# EasyEDA schematic SCH_Nucleo扩展板_LCD扩展板_v3_2022-11-11.json

## Sheets
1 连接器: TITLE: Sheet_1; REV: 1.0; Date: 2022-09-22; Sheet: 1/1; Company: Your Company
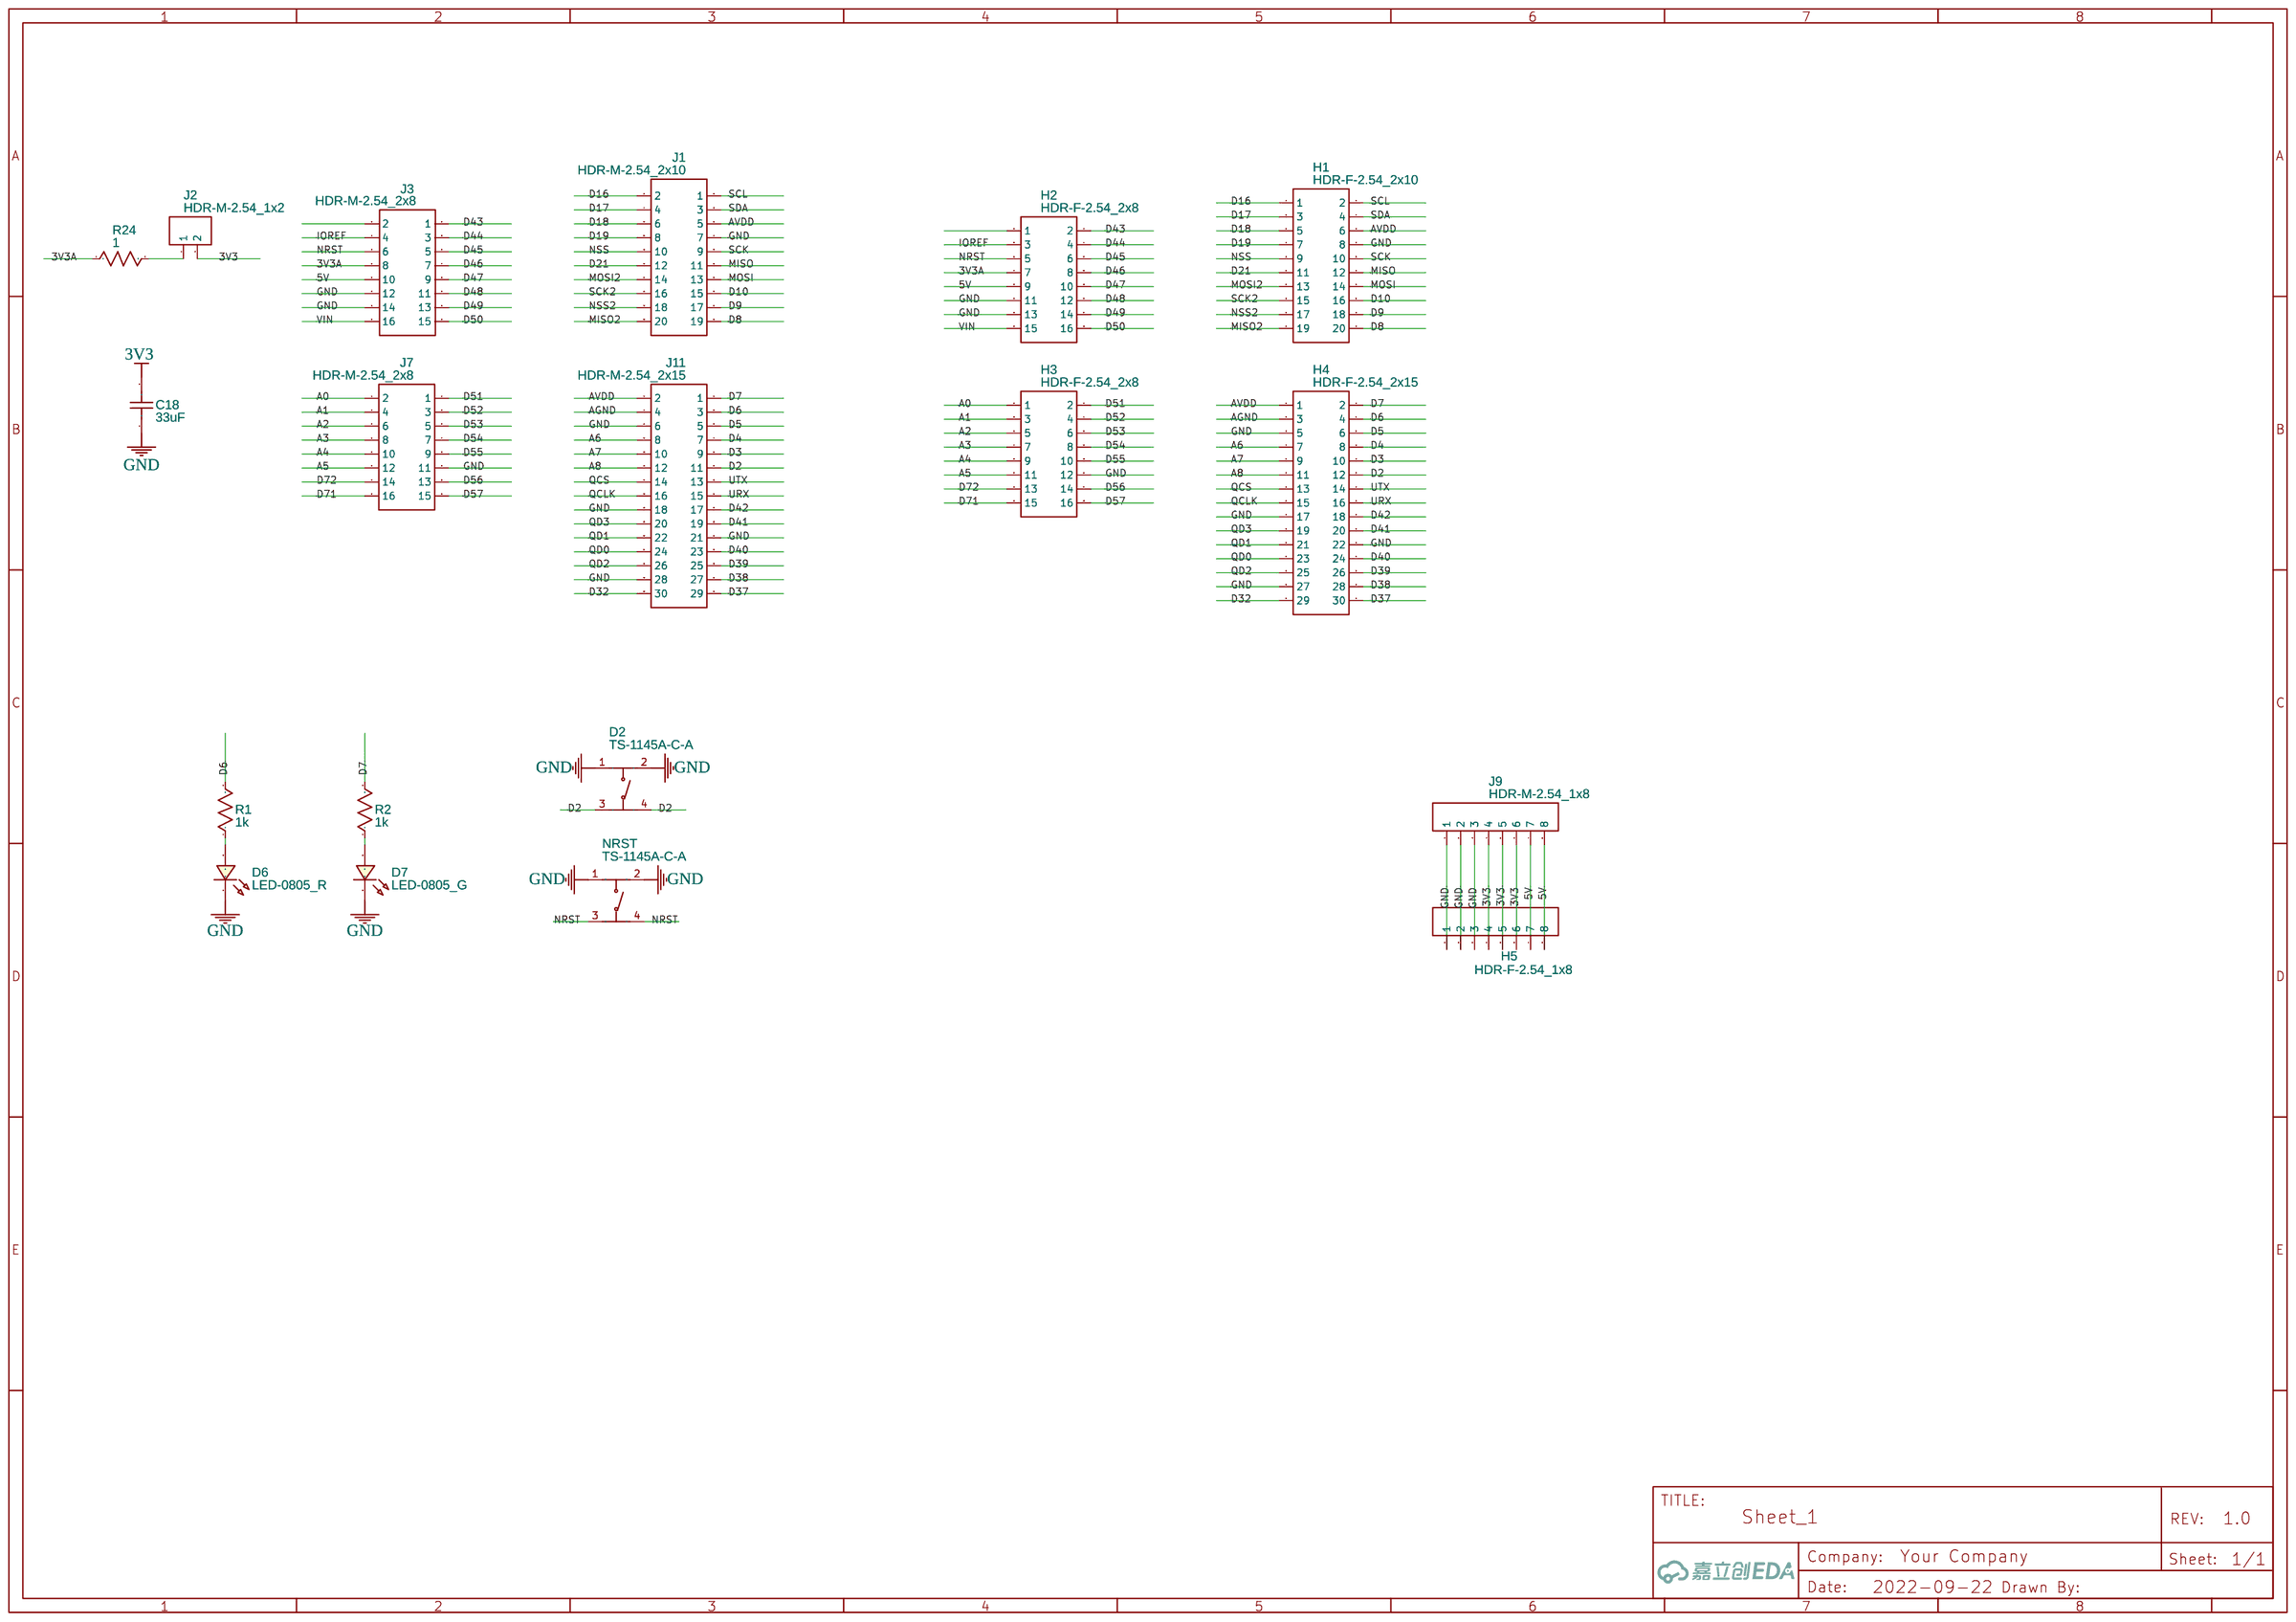
[diagram p0: 连接器]
2 存储: TITLE: Sheet_2; Date: 2022-09-23; Drawn By: minichao
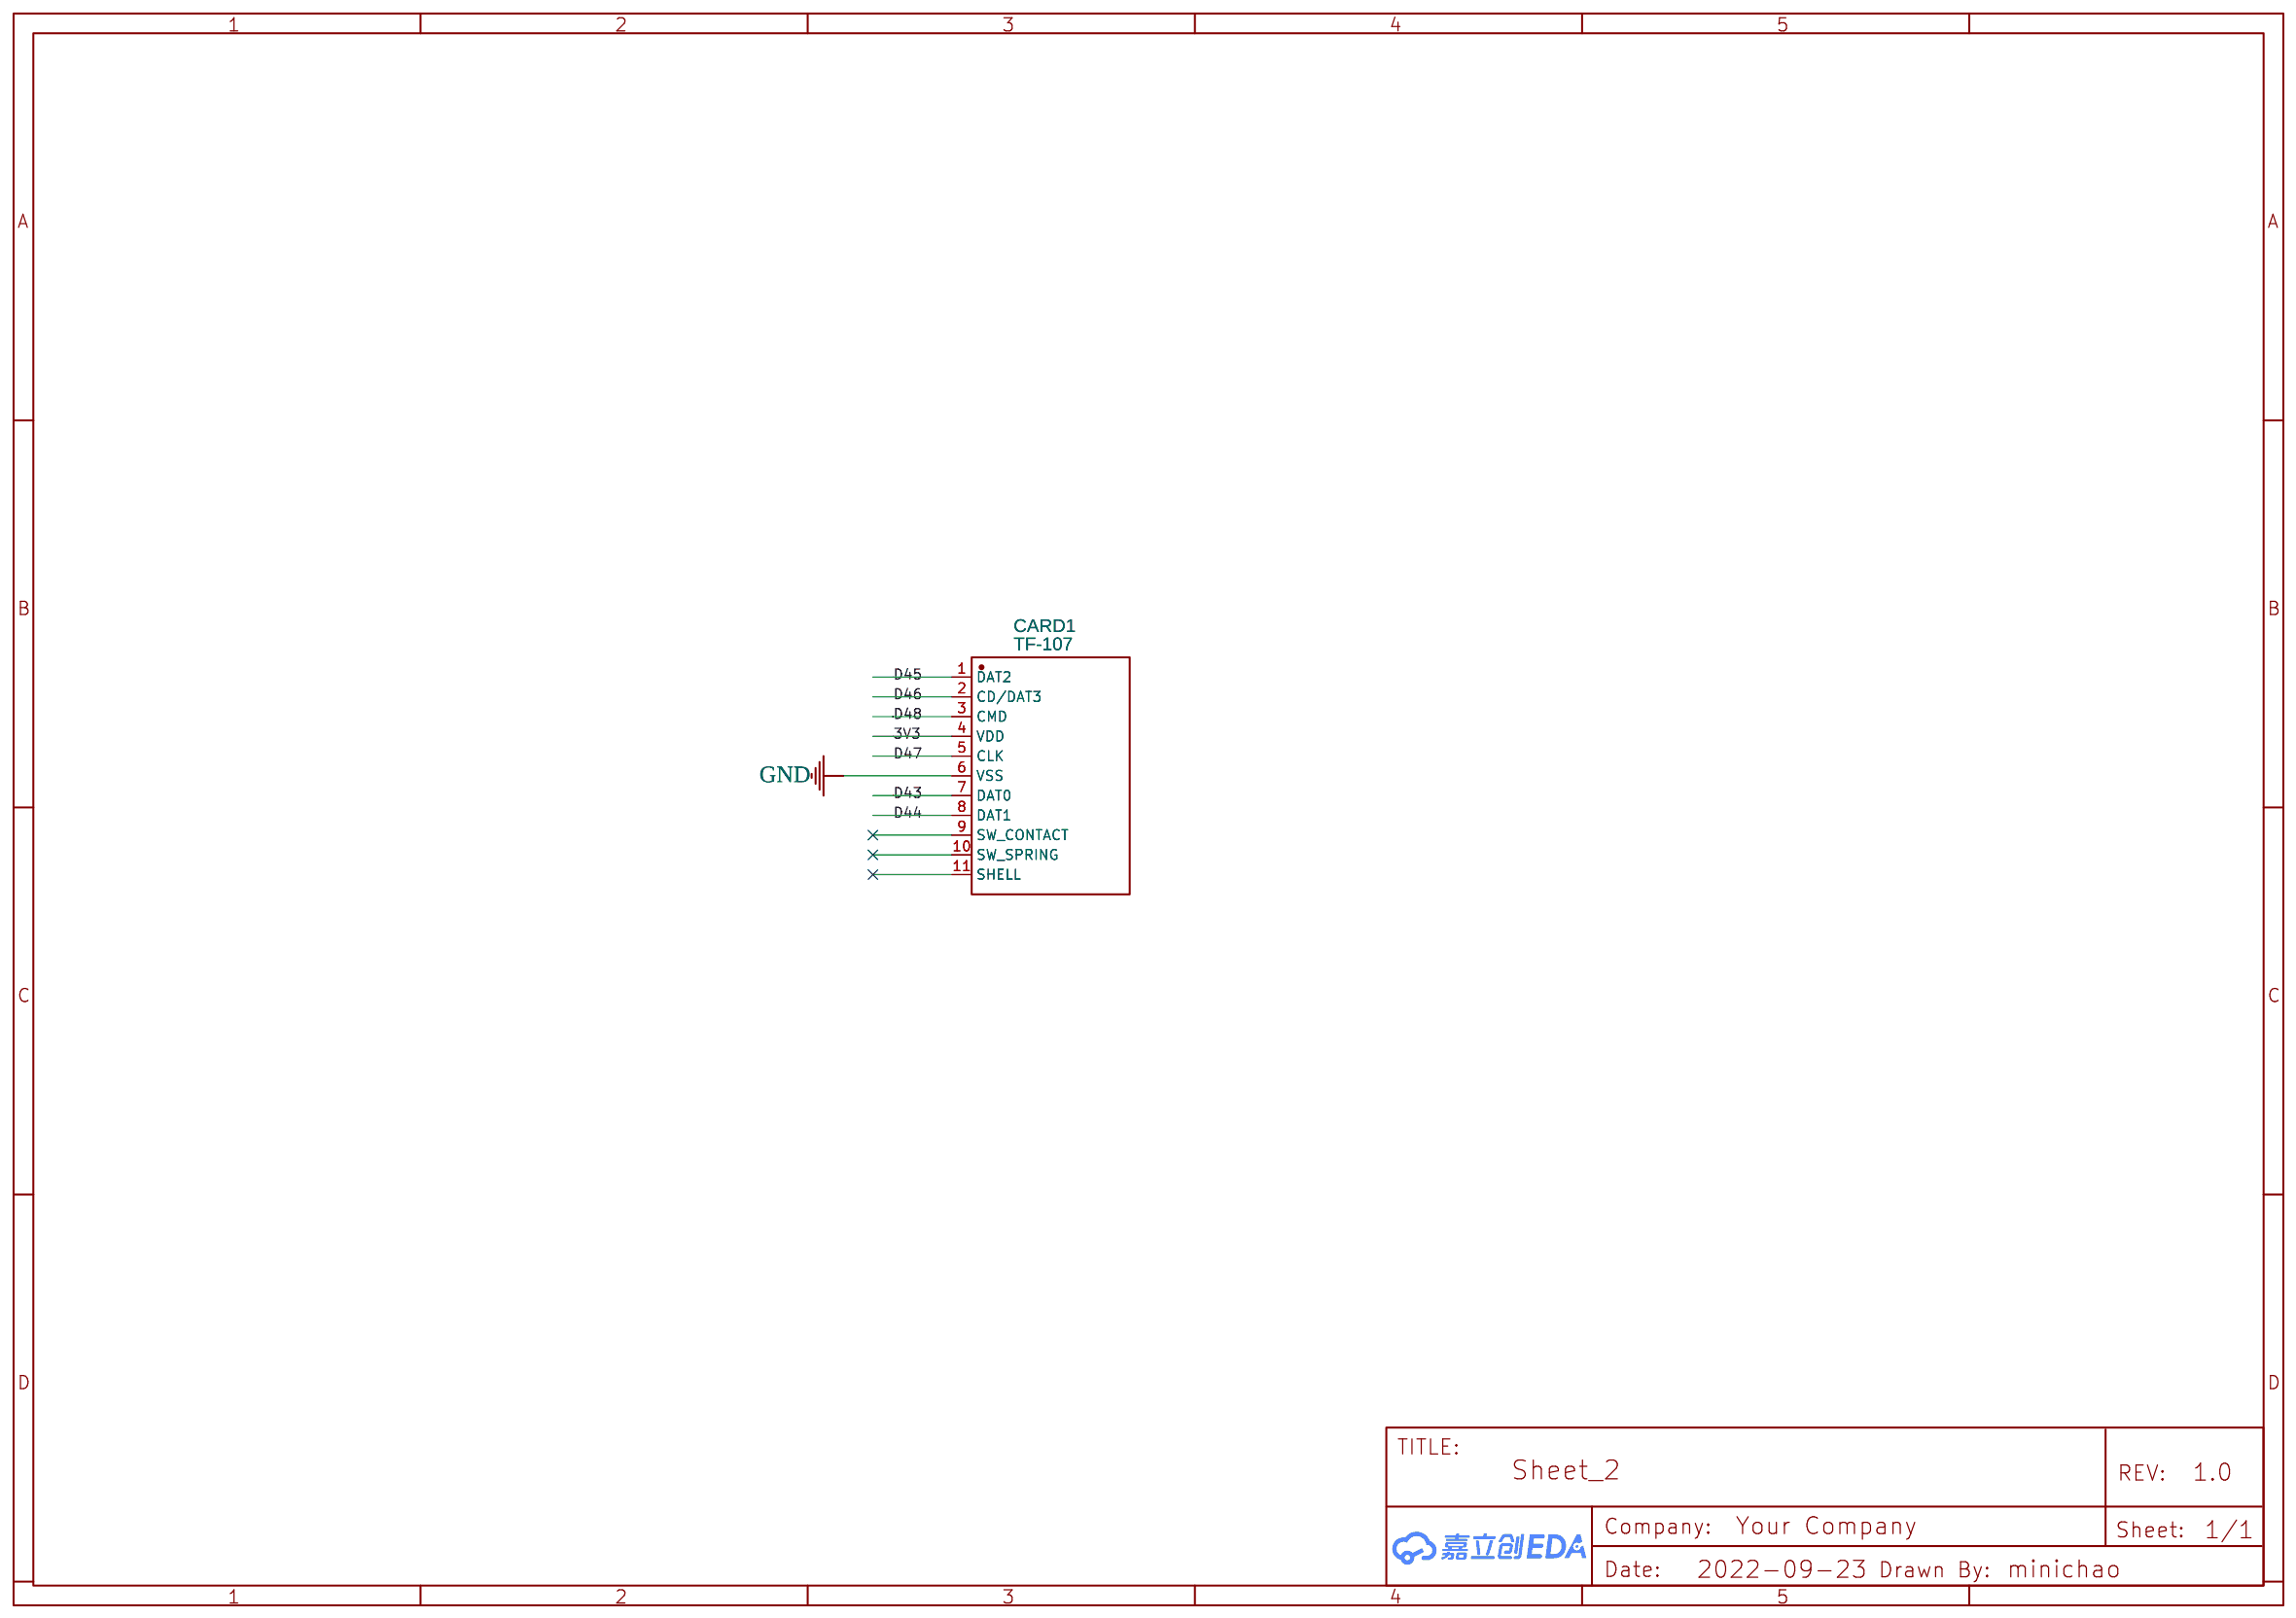
[diagram p1: 存储]
3 显示: Date: 2022-10-17
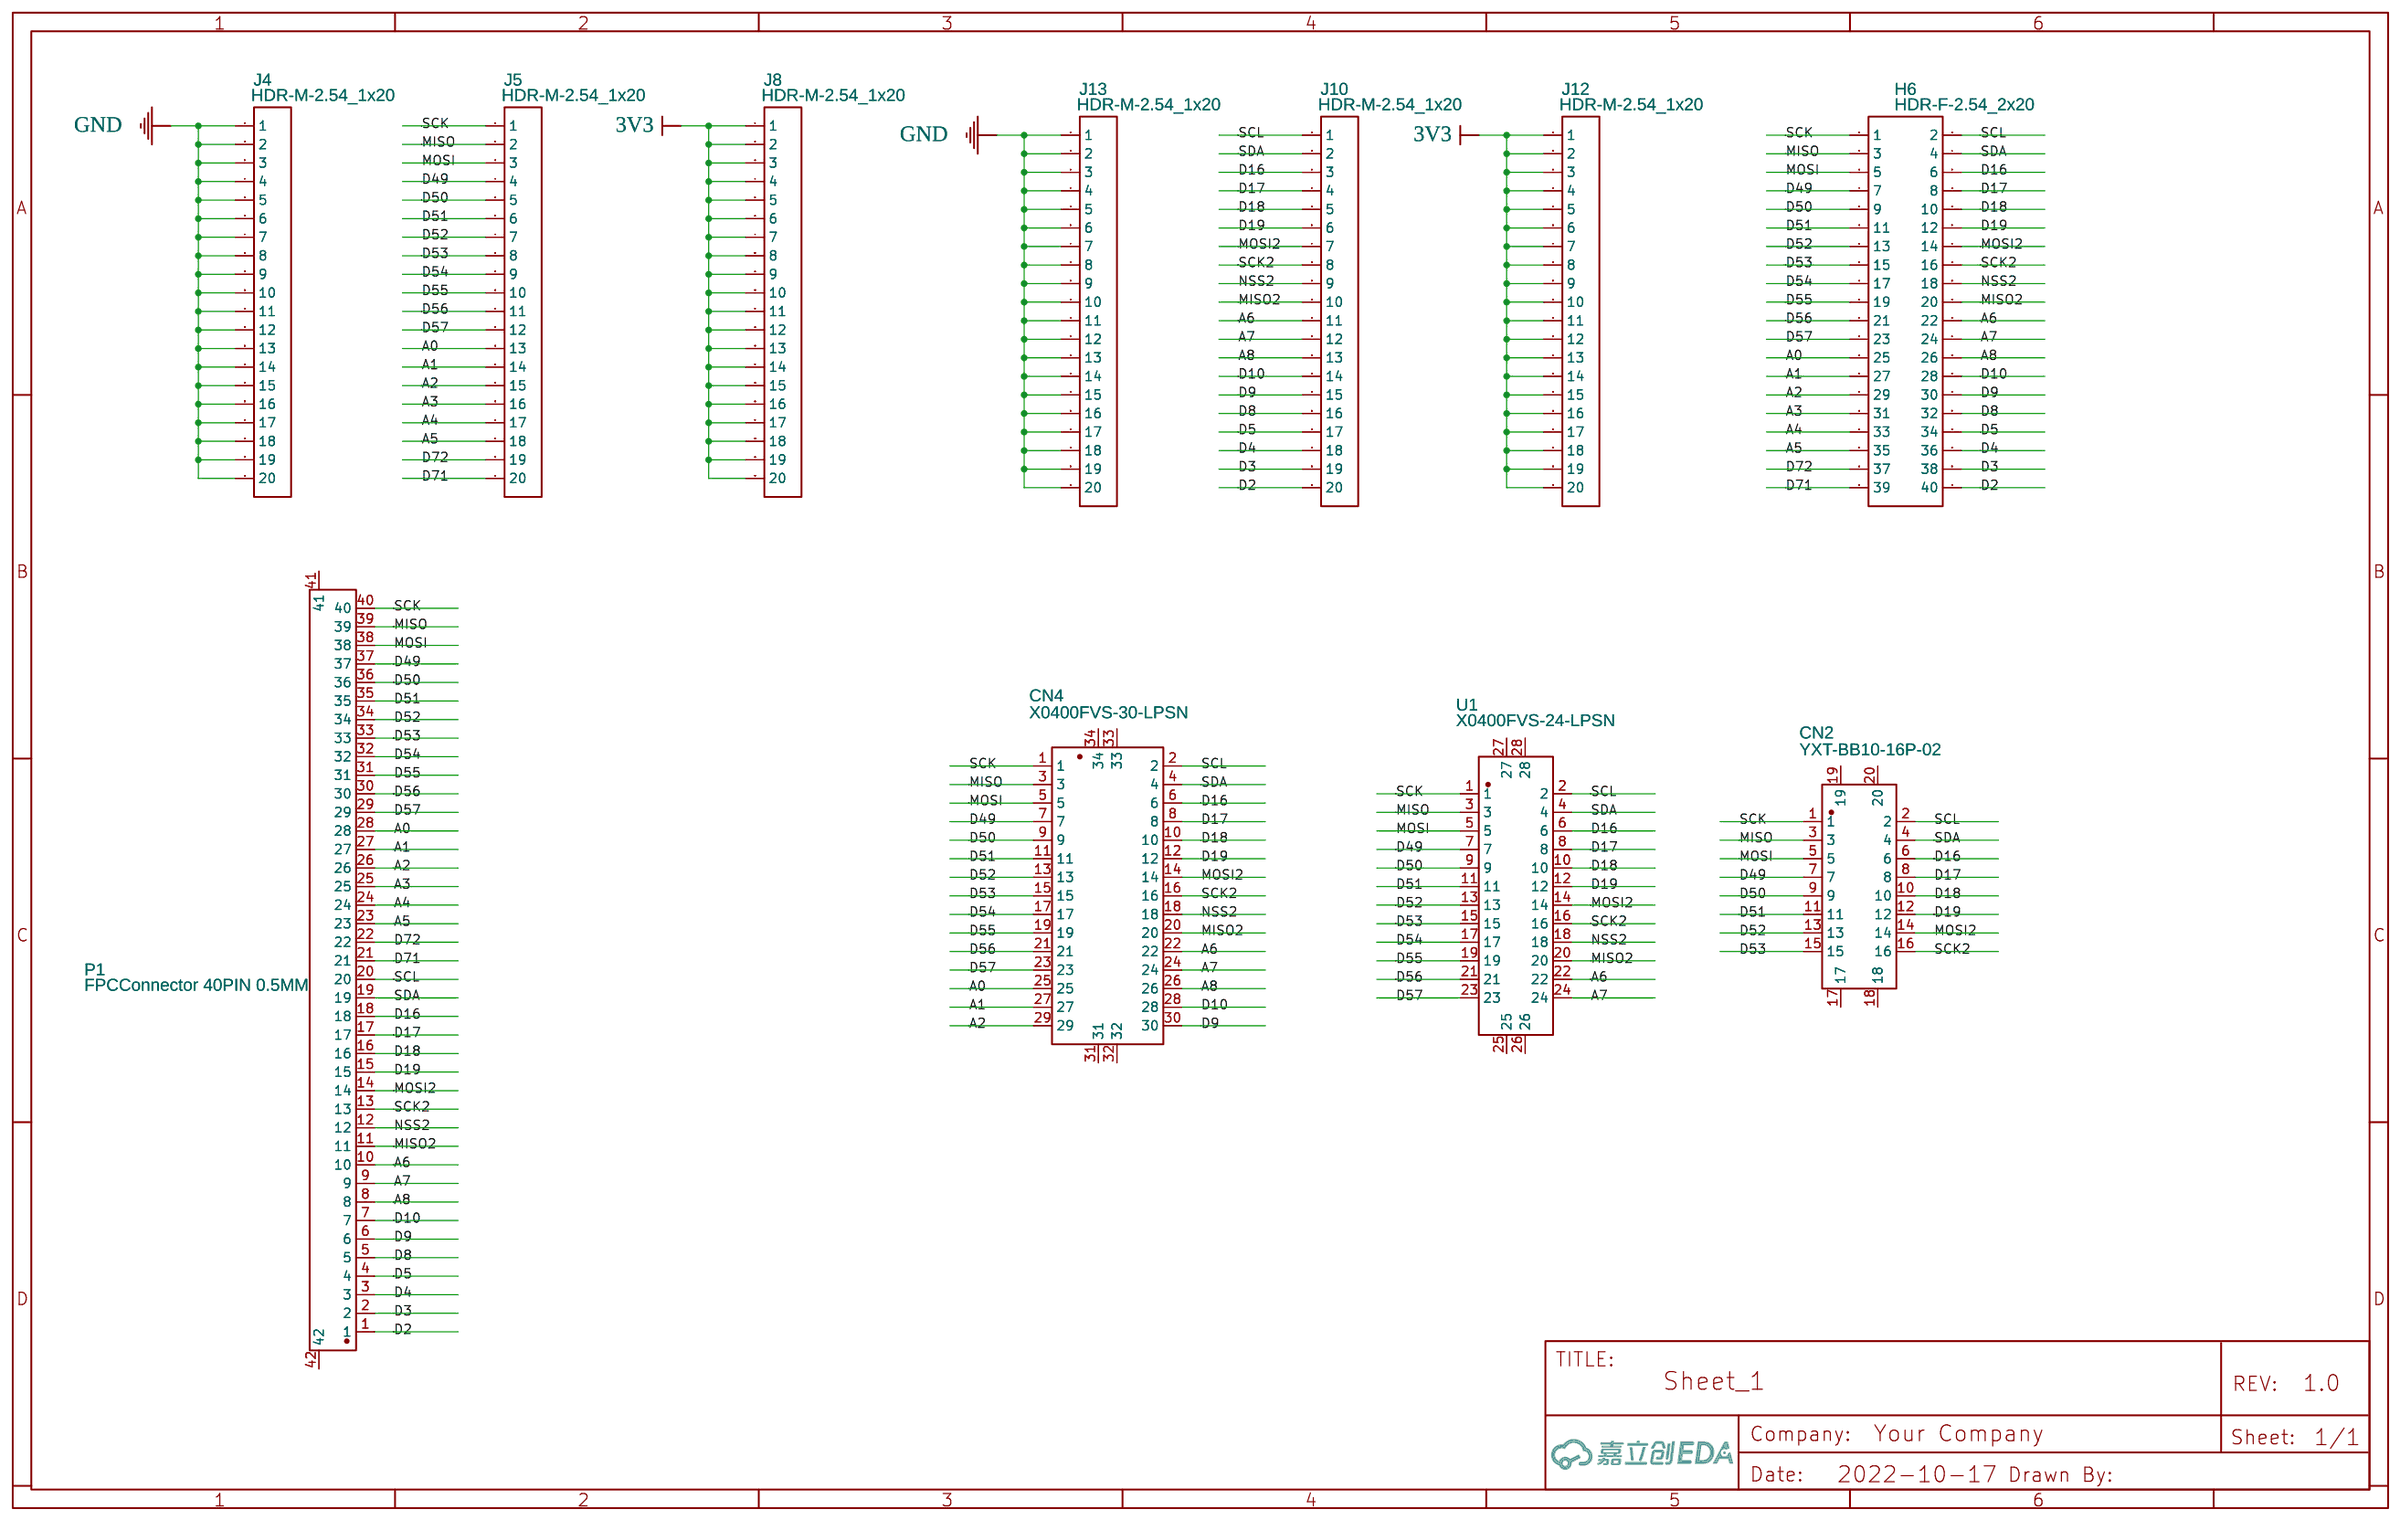
[diagram p2: 显示]

## Parts
sheet 存储
CARD1  TF-107  [TF-SMD_TF-107]
sheet 显示
CN2  YXT-BB10-16P-02  [CONN-SMD_YXT-BB10-16P-02]
CN4  X0400FVS-30-LPSN  [CONN-SMD_30P-P0.40_XKB_X0400FVS-30-LPSN]
H6  HDR-F-2.54_2x20  [HDR-F-2.54_2X20]
J4  HDR-M-2.54_1x20  [HDR-M-2.54_1X20]
J5  HDR-M-2.54_1x20  [HDR-M-2.54_1X20]
J8  HDR-M-2.54_1x20  [HDR-M-2.54_1X20]
J10  HDR-M-2.54_1x20  [HDR-M-2.54_1X20]
J12  HDR-M-2.54_1x20  [HDR-M-2.54_1X20]
J13  HDR-M-2.54_1x20  [HDR-M-2.54_1X20]
P1  FPCConnector 40PIN 0.5MM  [FPC-SMD_40P-P0.50_FG-H2.0-40P]
U1  X0400FVS-24-LPSN  [CONN-SMD_24P-P0.40_XKB-CONNECTIVITY_X0400FVS-24-LPSN]
sheet 连接器
C18  33uF  [C1210]
D2  TS-1145A-C-A  [SW-SMD_4P-L4.2-W3.2-P2.15-LS4.6]
D6  LED-0805_R  [LED0805_RED]
D7  LED-0805_G  [LED0805_GREEN]
H1  HDR-F-2.54_2x10  [HDR-F-2.54_2X10]
H2  HDR-F-2.54_2x8  [HDR-F-2.54_2X8]
H3  HDR-F-2.54_2x8  [HDR-F-2.54_2X8]
H4  HDR-F-2.54_2x15  [HDR-F-2.54_2X15]
H5  HDR-F-2.54_1x8  [HDR-F-2.54_1X8]
J1  HDR-M-2.54_2x10  [HDR-M-2.54_2X10]
J2  HDR-M-2.54_1x2  [HDR-M-2.54_1X2]
J3  HDR-M-2.54_2x8  [HDR-M-2.54_2X8]
J7  HDR-M-2.54_2x8  [HDR-M-2.54_2X8]
J9  HDR-M-2.54_1x8  [HDR-M-2.54_1X8]
J11  HDR-M-2.54_2x15  [HDR-M-2.54_2X15]
NRST  TS-1145A-C-A  [SW-SMD_4P-L4.2-W3.2-P2.15-LS4.6]
R1  1k  [R0805]
R2  1k  [R0805]
R24  1  [R0805]

## Library data of the parts
CARD1 = TF-107: Supplier: LCSC; Supplier Part: C266615; Manufacturer: XUNPU(讯普); Contributor: LCSC; JLCPCB Part Class: Extended Part
CN2 = YXT-BB10-16P-02: Supplier: LCSC; Supplier Part: C2763972; Manufacturer: YXT(益鑫通）; Contributor: LCSC; JLCPCB Part Class: Extended Part
CN4 = X0400FVS-30-LPSN: Supplier: LCSC; Supplier Part: C2880693; Manufacturer: XKB Connectivity(中国星坤); link: https://atta.szlcsc.com//upload/public/pdf/source/20211011/4712BB2CA40C15BD9EEAF05406E55879.pdf; Contributor: LCSC
H6 = HDR-F-2.54_2x20: Supplier Part: C50982; Supplier: LCSC; Contributor: LCEDA_Lib
J4 J5 J8 J10 J12 J13 = HDR-M-2.54_1x20: Supplier Part: C50981; Supplier: LCSC; Contributor: LCEDA_Lib
P1 = FPCConnector 40PIN 0.5MM: Supplier: LCSC; Manufacturer: BOOMELE(博穆精密); Manufacturer Part: 0.5-40P翻盖; Supplier Part: C9160; JLCPCB Part Class: Extended Part
U1 = X0400FVS-24-LPSN: Supplier: LCSC; Supplier Part: C2880692; Manufacturer: XKB Connectivity(中国星坤); Contributor: LCSC; JLCPCB Part Class: Extended Part
C18 = C3225X5R0J336MT0A0N: Supplier: LCSC; Supplier Part: C695362; Manufacturer: TDK; Contributor: LCSC; JLCPCB Part Class: Extended Part
D2 NRST = TS-1145A-C-A: Supplier: LCSC; Supplier Part: C318903; Manufacturer: XKB Enterprise; Contributor: LCSC; JLCPCB Part Class: Extended Part
D6 = LED-0805_R: Manufacturer: EVERLIGHT(台湾亿光); Manufacturer Part: 17-21SURC/S530-A3/TR8; Supplier Part: C72037; Contributor: LCEDA_Lib
D7 = LED-0805_G: Manufacturer: 国星光电; Manufacturer Part: NCD0805G1; Supplier Part: C84260; Contributor: LCEDA_Lib
H1 = HDR-F-2.54_2x10: Supplier Part: C30867; Supplier: LCSC; Contributor: LCEDA_Lib
H2 H3 = HDR-F-2.54_2x8: Supplier Part: C30734; Supplier: LCSC; Contributor: LCEDA_Lib
H4 = HDR-F-2.54_2x15: Supplier Part: C169818; Supplier: LCSC; Contributor: LCEDA_Lib
H5 = HDR-F-2.54_1x8: Supplier Part: C225505; Supplier: LCSC; Contributor: LCEDA_Lib
J1 = HDR-M-2.54_2x10: Supplier Part: C124359; Supplier: LCSC; Contributor: LCEDA_Lib
J2 = HDR-M-2.54_1x2: Supplier Part: C124375; Supplier: LCSC; Contributor: LCEDA_Lib
J3 J7 = HDR-M-2.54_2x8: Supplier Part: C68234; Supplier: LCSC; Contributor: LCEDA_Lib
J9 = HDR-M-2.54_1x8: Supplier Part: C190820; Supplier: LCSC; Contributor: LCEDA_Lib
J11 = HDR-M-2.54_2x15: Supplier Part: C56496; Supplier: LCSC; Contributor: LCEDA_Lib
R1 R2 = R_0805_US: Supplier Part: C75781; Supplier: LCSC; Contributor: LCEDA_Lib; Manufacturer Part: TC0525F1001T5E; Manufacturer: UniOhm
R24 = R_0805_US: Contributor: LCEDA_Lib

## Nets
3V3: C18.2 CARD1.4(VDD) H5.4 H5.5 H5.6 J2.2 J8.1 J8.2 J8.3 J8.4 J8.5 J8.6 J8.7 J8.8 J8.9 J8.10 J8.11 J8.12 J8.13 J8.14 J8.15 J8.16 J8.17 J8.18 J8.19 J8.20 J9.4 J9.5 J9.6 J12.1 J12.2 J12.3 J12.4 J12.5 J12.6 J12.7 J12.8 J12.9 J12.10 J12.11 J12.12 J12.13 J12.14 J12.15 J12.16 J12.17 J12.18 J12.19 J12.20
3V3A: H2.7 J3.8 R24.1
5V: H2.9 H5.7 H5.8 J3.10 J9.7 J9.8
AGND: H4.3 J11.4
AVDD: H1.6 H4.1 J1.5 J11.2
GND: C18.1 CARD1.6(VSS) D2.1 D2.2 D6.2 D7.2 H1.8 H2.11 H2.13 H3.12 H4.5 H4.17 H4.22 H4.27 H5.1 H5.2 H5.3 J1.7 J3.12 J3.14 J4.1 J4.2 J4.3 J4.4 J4.5 J4.6 J4.7 J4.8 J4.9 J4.10 J4.11 J4.12 J4.13 J4.14 J4.15 J4.16 J4.17 J4.18 J4.19 J4.20 J7.11 J9.1 J9.2 J9.3 J11.6 J11.18 J11.21 J11.28 J13.1 J13.2 J13.3 J13.4 J13.5 J13.6 J13.7 J13.8 J13.9 J13.10 J13.11 J13.12 J13.13 J13.14 J13.15 J13.16 J13.17 J13.18 J13.19 J13.20 NRST.1 NRST.2
VIN: H2.15 J3.16
A0: CN4.25 H3.1 H6.25 J5.13 J7.2 P1.28
A1: CN4.27 H3.3 H6.27 J5.14 J7.4 P1.27
A2: CN4.29 H3.5 H6.29 J5.15 J7.6 P1.26
A3: H3.7 H6.31 J5.16 J7.8 P1.25
A4: H3.9 H6.33 J5.17 J7.10 P1.24
A5: H3.11 H6.35 J5.18 J7.12 P1.23
A6: CN4.22 H4.7 H6.22 J10.11 J11.8 P1.10 U1.22
A7: CN4.24 H4.9 H6.24 J10.12 J11.10 P1.9 U1.24
A8: CN4.26 H4.11 H6.26 J10.13 J11.12 P1.8
D2: D2.3 D2.4 H4.12 H6.40 J10.20 J11.11 P1.1
D3: H4.10 H6.38 J10.19 J11.9 P1.2
D4: H4.8 H6.36 J10.18 J11.7 P1.3
D5: H4.6 H6.34 J10.17 J11.5 P1.4
D6: H4.4 J11.3 R1.2
D7: H4.2 J11.1 R2.2
D8: H1.20 H6.32 J1.19 J10.16 P1.5
D9: CN4.30 H1.18 H6.30 J1.17 J10.15 P1.6
D10: CN4.28 H1.16 H6.28 J1.15 J10.14 P1.7
D16: CN2.6 CN4.6 H1.1 H6.6 J1.2 J10.3 P1.18 U1.6
D17: CN2.8 CN4.8 H1.3 H6.8 J1.4 J10.4 P1.17 U1.8
D18: CN2.10 CN4.10 H1.5 H6.10 J1.6 J10.5 P1.16 U1.10
D19: CN2.12 CN4.12 H1.7 H6.12 J1.8 J10.6 P1.15 U1.12
D21: H1.11 J1.12
D32: H4.29 J11.30
D37: H4.30 J11.29
D38: H4.28 J11.27
D39: H4.26 J11.25
D40: H4.24 J11.23
D41: H4.20 J11.19
D42: H4.18 J11.17
D43: CARD1.7(DAT0) H2.2 J3.1
D44: CARD1.8(DAT1) H2.4 J3.3
D45: CARD1.1(DAT2) H2.6 J3.5
D46: CARD1.2(CD/DAT3) H2.8 J3.7
D47: CARD1.5(CLK) H2.10 J3.9
D48: CARD1.3(CMD) H2.12 J3.11
D49: CN2.7 CN4.7 H2.14 H6.7 J3.13 J5.4 P1.37 U1.7
D50: CN2.9 CN4.9 H2.16 H6.9 J3.15 J5.5 P1.36 U1.9
D51: CN2.11 CN4.11 H3.2 H6.11 J5.6 J7.1 P1.35 U1.11
D52: CN2.13 CN4.13 H3.4 H6.13 J5.7 J7.3 P1.34 U1.13
D53: CN2.15 CN4.15 H3.6 H6.15 J5.8 J7.5 P1.33 U1.15
D54: CN4.17 H3.8 H6.17 J5.9 J7.7 P1.32 U1.17
D55: CN4.19 H3.10 H6.19 J5.10 J7.9 P1.31 U1.19
D56: CN4.21 H3.14 H6.21 J5.11 J7.13 P1.30 U1.21
D57: CN4.23 H3.16 H6.23 J5.12 J7.15 P1.29 U1.23
D71: H3.15 H6.39 J5.20 J7.16 P1.21
D72: H3.13 H6.37 J5.19 J7.14 P1.22
IOREF: H2.3 J3.4
MISO: CN2.3 CN4.3 H1.12 H6.3 J1.11 J5.2 P1.39 U1.3
MISO2: CN4.20 H1.19 H6.20 J1.20 J10.10 P1.11 U1.20
MOSI: CN2.5 CN4.5 H1.14 H6.5 J1.13 J5.3 P1.38 U1.5
MOSI2: CN2.14 CN4.14 H1.13 H6.14 J1.14 J10.7 P1.14 U1.14
NRST: H2.5 J3.6 NRST.3 NRST.4
NSS: H1.9 J1.10
NSS2: CN4.18 H1.17 H6.18 J1.18 J10.9 P1.12 U1.18
QCLK: H4.15 J11.16
QCS: H4.13 J11.14
QD0: H4.23 J11.24
QD1: H4.21 J11.22
QD2: H4.25 J11.26
QD3: H4.19 J11.20
SCK: CN2.1 CN4.1 H1.10 H6.1 J1.9 J5.1 P1.40 U1.1
SCK2: CN2.16 CN4.16 H1.15 H6.16 J1.16 J10.8 P1.13 U1.16
SCL: CN2.2 CN4.2 H1.2 H6.2 J1.1 J10.1 P1.20 U1.2
SDA: CN2.4 CN4.4 H1.4 H6.4 J1.3 J10.2 P1.19 U1.4
URX: H4.16 J11.15
UTX: H4.14 J11.13
Net-(D6-1): D6.1 R1.1
Net-(D7-1): D7.1 R2.1
Net-(J2-1): J2.1 R24.2

Not connected (* = marked no-connect by the designer): CARD1 9(SW_CONTACT) 10(SW_SPRING) 11(SHELL); CN2 17 18 19 20; CN4 31 32 33 34; H2 1; J3 2; P1 41 42; U1 25 26 27 28
